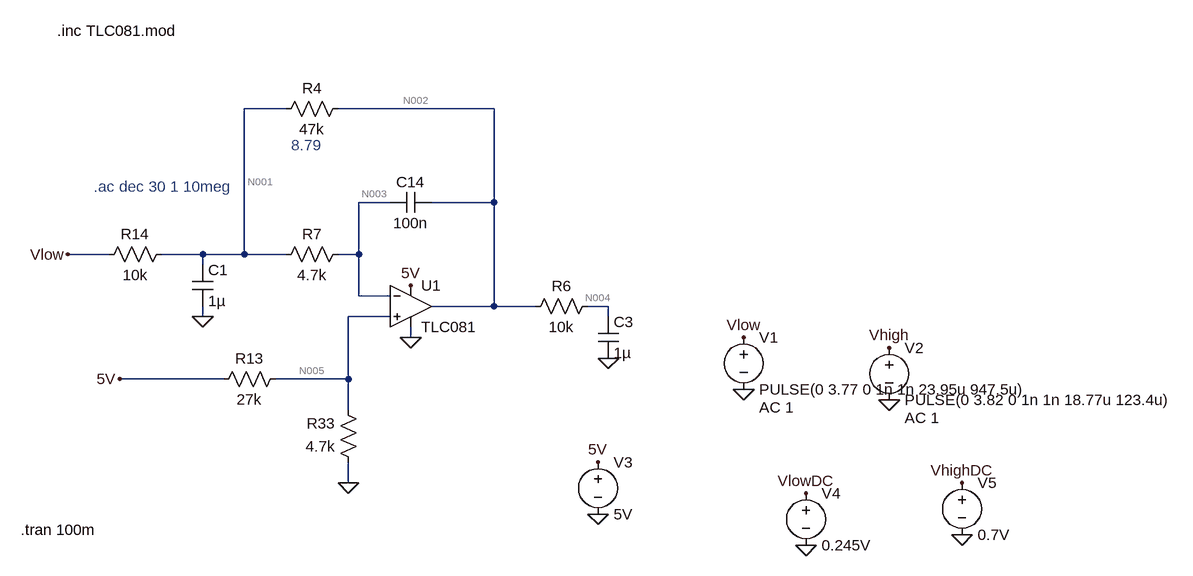
[diagram p0: schematic MFB - Copy.asc]
MFB - Copy.asc, the LTspice schematic file:
Version 4.1
SHEET 1 1768 680
WIRE 272 -112 208 -112
WIRE 592 -112 352 -112
WIRE 432 32 384 32
WIRE 592 32 592 -112
WIRE 592 32 496 32
WIRE 0 112 -64 112
WIRE 144 112 80 112
WIRE 208 112 208 -112
WIRE 208 112 144 112
WIRE 272 112 208 112
WIRE 384 112 384 32
WIRE 384 112 352 112
WIRE 144 128 144 112
WIRE 384 176 384 112
WIRE 432 176 384 176
WIRE 592 192 592 32
WIRE 592 192 496 192
WIRE 656 192 592 192
WIRE 768 192 736 192
WIRE 144 208 144 192
WIRE 432 208 368 208
WIRE 768 208 768 192
WIRE 464 240 464 224
WIRE 176 304 16 304
WIRE 368 304 368 208
WIRE 368 304 256 304
WIRE 368 352 368 304
WIRE 368 464 368 432
FLAG -64 112 Vlow
FLAG 16 304 5V
FLAG 368 464 0
FLAG 144 208 0
FLAG 976 320 0
FLAG 1200 336 0
FLAG 976 240 Vlow
FLAG 1200 256 Vhigh
FLAG 752 432 5V
FLAG 752 512 0
FLAG 464 160 5V
FLAG 464 240 0
FLAG 768 272 0
FLAG 1072 560 0
FLAG 1072 480 VlowDC
FLAG 1312 544 0
FLAG 1312 464 VhighDC
SYMBOL res 96 96 R90
WINDOW 0 0 56 VBottom 2
WINDOW 3 32 56 VTop 2
SYMATTR InstName R14
SYMATTR Value 10k
SYMBOL res 368 96 R90
WINDOW 0 0 56 VBottom 2
WINDOW 3 32 56 VTop 2
SYMATTR InstName R7
SYMATTR Value 4.7k
SYMBOL res 272 288 R90
WINDOW 0 0 56 VBottom 2
WINDOW 3 32 56 VTop 2
SYMATTR InstName R13
SYMATTR Value 27k
SYMBOL res 384 448 R180
WINDOW 0 36 76 Left 2
WINDOW 3 36 40 Left 2
SYMATTR InstName R33
SYMATTR Value 4.7k
SYMBOL res 256 -96 R270
WINDOW 0 32 56 VTop 2
WINDOW 3 0 56 VBottom 2
SYMATTR InstName R4
SYMATTR Value 47k
SYMBOL OpAmps\\opamp2 464 128 R0
SYMATTR InstName U1
SYMATTR Value TLC081
SYMBOL cap 128 128 R0
SYMATTR InstName C1
SYMATTR Value 1µ
SYMBOL voltage 976 224 R0
WINDOW 123 24 124 Left 2
WINDOW 39 0 0 Left 0
SYMATTR Value2 AC 1
SYMATTR InstName V1
SYMATTR Value PULSE(0 3.77 0 1n 1n 23.95u 947.5u)
SYMBOL voltage 1200 240 R0
WINDOW 123 24 124 Left 2
WINDOW 39 0 0 Left 0
SYMATTR Value2 AC 1
SYMATTR InstName V2
SYMATTR Value PULSE(0 3.82 0 1n 1n 18.77u 123.4u)
SYMBOL voltage 752 416 R0
WINDOW 123 0 0 Left 0
WINDOW 39 0 0 Left 0
SYMATTR InstName V3
SYMATTR Value 5V
SYMBOL cap 496 16 R90
WINDOW 0 0 32 VBottom 2
WINDOW 3 32 32 VTop 2
SYMATTR InstName C14
SYMATTR Value 100n
SYMBOL res 752 176 R90
WINDOW 0 0 56 VBottom 2
WINDOW 3 32 56 VTop 2
SYMATTR InstName R6
SYMATTR Value 10k
SYMBOL cap 752 208 R0
SYMATTR InstName C3
SYMATTR Value 1µ
SYMBOL voltage 1072 464 R0
WINDOW 123 0 0 Left 0
WINDOW 39 0 0 Left 0
SYMATTR InstName V4
SYMATTR Value 0.245V
SYMBOL voltage 1312 448 R0
WINDOW 123 0 0 Left 0
WINDOW 39 0 0 Left 0
SYMATTR InstName V5
SYMATTR Value 0.7V
TEXT -80 -232 Left 2 !.inc TLC081.mod
TEXT -136 536 Left 2 !.tran 100m
TEXT 280 -56 Left 2 ;8.79
TEXT -24 8 Left 2 ;.ac dec 30 1 10meg

The netlist it stands for:
* MFB - Copy.asc
R14 N001 Vlow 10k
R7 N003 N001 4.7k
R13 N005 5V 27k
R33 0 N005 4.7k
R4 N001 N002 47k
X§U1 N005 N003 5V 0 N002 TLC081  ; pins In+ In- V+ V- OUT
C1 N001 0 1µ
V1 Vlow 0 PULSE(0 3.77 0 1n 1n 23.95u 947.5u) AC 1
V2 Vhigh 0 PULSE(0 3.82 0 1n 1n 18.77u 123.4u) AC 1
V3 5V 0 5V
C14 N002 N003 100n
R6 N004 N002 10k
C3 N004 0 1µ
V4 VlowDC 0 0.245V
V5 VhighDC 0 0.7V
.inc TLC081.mod
.tran 100m
* 8.79
* .ac dec 30 1 10meg
.backanno
.end

* Results of the author's LTspice run, read from the files saved beside the schematic
* Operating Point, zero values left out:
*   V(5v) = 5 V
*   V(n001) = 752.9 mV
*   V(n002) = 4.292 V
*   V(n003) = 752.9 mV
*   V(n004) = 4.292 V
*   V(n005) = 741.3 mV
*   V(vhighdc) = 700 mV
*   V(vlowdc) = 245 mV
*   I(R13) = -157.7 µA
*   I(R14) = 75.29 µA
*   I(R33) = -157.7 µA
*   I(R4) = -75.29 µA
*   I(R7) = -1.144 pA
*   I(V1) = 75.29 µA
*   I(V3) = 14.52 mA
*   Ix(u1:1) = 1.12 pA
*   Ix(u1:2) = 1.144 pA
*   Ix(u1:3) = -14.68 mA
*   Ix(u1:4) = -957.2 µA
*   Ix(u1:5) = -75.29 µA
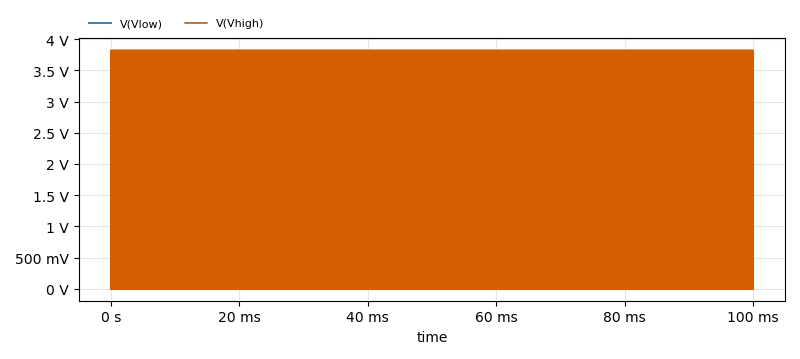
[diagram p1: Transient Analysis of MFB - Copy.asc, plotted from the saved traces]
* Transient Analysis, 1 run:
*   V(Vlow): min 0 V, max 3.77 V, average 95.71 mV, rms 600.7 mV, last 0 V
*   V(Vhigh): min 0 V, max 3.82 V, average 581.5 mV, rms 1.49 V, last 0 V